# Altium schematic sheet Snippet of WM8804.SchDoc
size A4
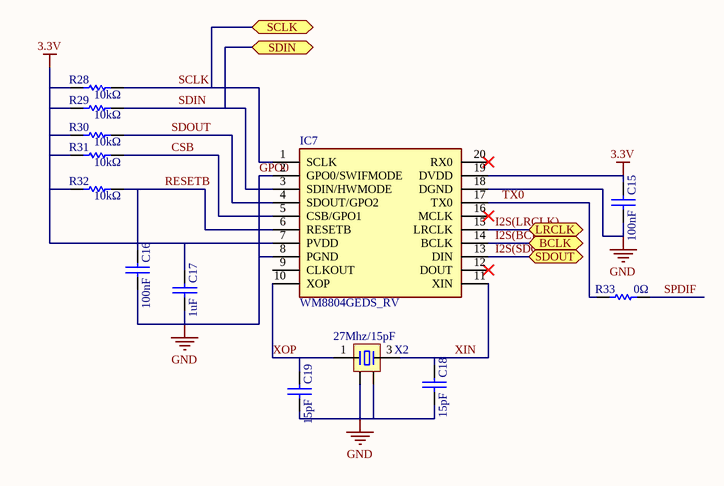
[diagram p0: Snippet of WM8804.SchDoc]

## Parts
C15  100nF  [C_0603]
C16  100nF  [C_0603]
C17  1uF  [C_0603]
C18  15pF  [C_0603]
C19  15pF  [C_0603]
IC7  WM8804GEDS_RV  [SOP65P780X200-20N]
R28  10kΩ  [R_0603]
R29  10kΩ  [R_0603]
R30  10kΩ  [R_0603]
R31  10kΩ  [R_0603]
R32  10kΩ  [R_0603]
R33  0Ω  [R_0603]
X2  27Mhz/15pF  [XTAL_3225-4P]

## Ports
BCLK (bidir), LRCLK (bidir), SCLK (bidir), SDIN (bidir), SDOUT (bidir)

## Nets
3.3V: C15.1 C17.1 IC7.7(PVDD) IC7.19(DVDD) R28.1 R29.1 R30.1 R31.1 R32.1
GPO0: C15.2 C16.2 C17.2 C18.2 C19.2 IC7.2(GPO0/SWIFMODE) IC7.8(PGND) IC7.18(DGND) X2.2 X2.4  [also labelled GND]
CSB: IC7.5(CSB/GPO1) R31.2
I2S(BCLK): IC7.14(BCLK) ; port BCLK
I2S(LRCLK): IC7.15(LRCLK) ; port LRCLK
I2S(SDOUT): IC7.13(DIN) ; port SDOUT
RESETB: C16.1 IC7.6(RESETB) R32.2
SCLK: IC7.1(SCLK) R28.2 ; port SCLK
SDIN: IC7.3(SDIN/HWMODE) R29.2 ; port SDIN
SDOUT: IC7.4(SDOUT/GPO2) R30.2
SPDIF: R33.2
TX0: IC7.17(TX0) R33.1
XIN: C18.1 IC7.11(XIN) X2.3
XOP: C19.1 IC7.10(XOP) X2.1

Not connected (* = marked no-connect by the designer): IC7 9(CLKOUT) 12(DOUT)* 16(MCLK)* 20(RX0)*

## Library data of the parts
C15-C19 = Cap_Chip: 贴片电容; 厂家型号: *; 商品编号: *
IC7 = WM8804GEDS_RV: Integrated Circuit; Manufacturer_Name: Cirrus Logic; Manufacturer_Part_Number: WM8804GEDS/RV; Datasheet Link: https://d3uzseaevmutz1.cloudfront.net/pubs/proDatasheet/WM8804_v4.5.pdf; Height: 2mm; Mouser Part Number: 238-WM8804GEDS/RV; Mouser Price/Stock: https://www.mouser.co.uk/ProductDetail/Cirrus-Logic/WM8804GEDS-RV?qs=%2F%252BPMR94VuMYwzSe6qKCihg%3D%3D
R28-R33 = Res_Chip: 贴片电阻; 商品编号: *; 厂家型号: *
X2 = Crystal_4P: 4脚无源晶振; 厂家型号: *; 商品编号: *